# Altium schematic sheet 12VPower.SchDoc
size A4
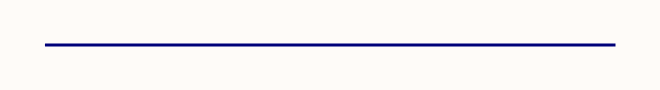
[diagram p0: 12VPower.SchDoc]